# Altium schematic sheet ChildBoard.SchDoc
size A4
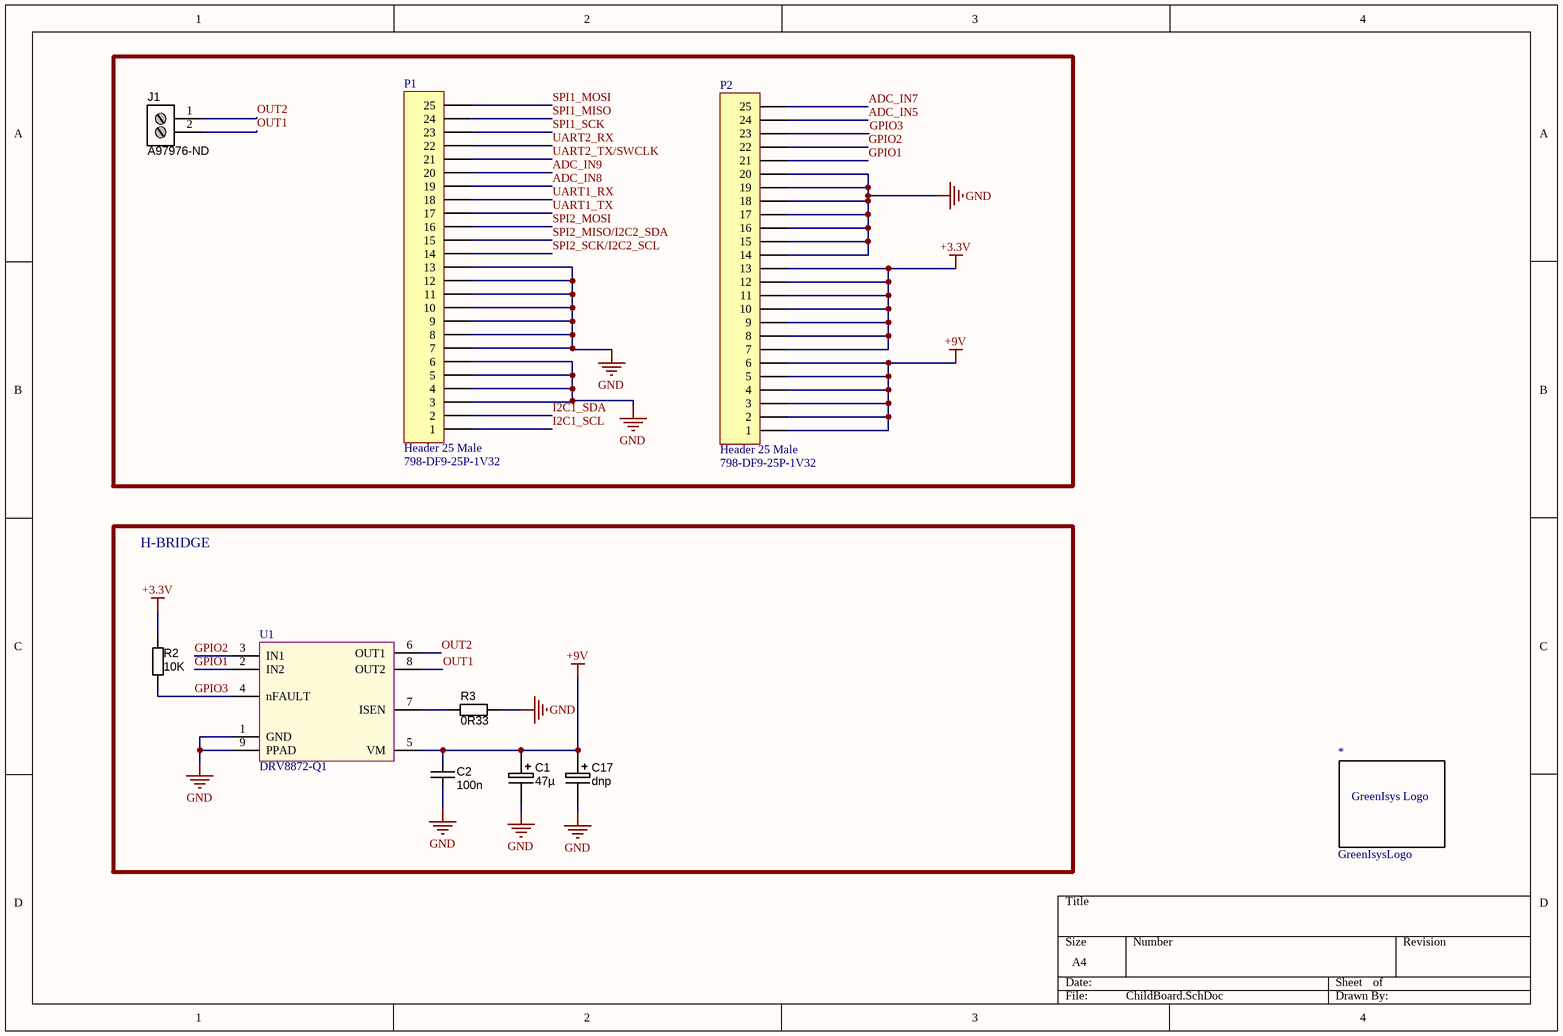
[diagram p0: ChildBoard.SchDoc]

## Parts
*  GreenIsysLogo  [GreenIsys]
C1  47µ  [CAP_ELEC_Size_H13]
C2  value 100n  [CAPC1608N]  (hidden comment: approved sub OK)
C17  dnp  [CAPMP3528X210N]
J1  Supplier Part Number 1: A97976-ND  [2P_PCB_ScrewTerm_90S_3.81MM]  (hidden comment: Stackable ScrewTerm)
P1  Header 25 Male  Supplier Part Number 1: 798-DF9-25P-1V32  [DF9-25S-1V (MALE)]
P2  Header 25 Male  Supplier Part Number 1: 798-DF9-25P-1V32  [DF9-25S-1V (MALE)]
R2  value 10K  [RESC1608N]  (hidden comment: Thick Film)
R3  value 0R33  [RESC3225N]  (hidden comment: Thick Film)
U1  DRV8872-Q1  [HSOP-8-DDA]

## Blocks framed on the sheet
H-BRIDGE: C1 C2 C17 R2 R3 U1

## Nets
+3.3V: P2.7 P2.8 P2.9 P2.10 P2.11 P2.12 P2.13 R2.1
+9V: C1.1 C2.1 C17.1 P2.1 P2.2 P2.3 P2.4 P2.5 P2.6 U1.5(VM)
GND: C1.2 C2.2 C17.2 P1.3 P1.4 P1.5 P1.6 P1.7 P1.8 P1.9 P1.10 P1.11 P1.12 P1.13 P2.14 P2.15 P2.16 P2.17 P2.18 P2.19 P2.20 R3.1 U1.1(GND) U1.9(PPAD)
ADC_IN5: P2.24
ADC_IN7: P2.25
ADC_IN8: P1.19
ADC_IN9: P1.20
GPIO1: P2.21 U1.2(IN2)
GPIO2: P2.22 U1.3(IN1)
GPIO3: P2.23 R2.2 U1.4(nFAULT)
I2C1_SCL: P1.1
I2C1_SDA: P1.2
OUT1: J1.2 U1.8(OUT2)
OUT2: J1.1 U1.6(OUT1)
SPI1_MISO: P1.24
SPI1_MOSI: P1.25
SPI1_SCK: P1.23
SPI2_MISO/I2C2_SDA: P1.15
SPI2_MOSI: P1.16
SPI2_SCK/I2C2_SCL: P1.14
UART1_RX: P1.18
UART1_TX: P1.17
UART2_RX: P1.22
UART2_TX/SWCLK: P1.21
NetR3_2: R3.2 U1.7(ISEN)

## Notes on the sheet
- (in symbol GreenIsysLogo) GreenIsys Logo

## Library data of the parts
C1 = CAPE_47u_100V_SMD: Capacitor SMD Electrolytic 47uF 20% 100V Radial; Manufacturer 1: Panasonic - ECG; Manufacturer Part Number 1: EEV-TG2A470Q; Material: Aluminum Electrolytic; Package / Case: Radial - Surface Mount; Ratings: 100V; Tolerance: ±20%; Supplier 1: Mouser; Supplier Part Number 1: 667-EEV-TG2A470Q; Value: 47µ
C2 = CAPC_10n_0603_50V_10%: Capacitor SMD Cer 100nF 10% 10V X7R 0603; Manufacturer 1: AVX Corporation; Manufacturer Part Number 1: 0603ZC104KAT2A; Ratings: 10V; X7R; Material: ceramic; Package / Case: 0603 (1608 metric); Tolerance: ±10%; Supplier 1: Mouser; Supplier Part Number 1: 581-0603ZC104K; Supplier Unit Price 1: 0.281
C17 = CAPT_47u_3528_6V3: Capacitor SMD Tantalum 47uF 10% 6.3V EIA 3528-21; Manufacturer 1: Kemet; Manufacturer Part Number 1: T489B476K006ATE500; Manufacturer Size Code: A; Material: Solid Tantalum; ESR (Equivalent Series Resistance): 4.000 Ohm; Package / Case: (3528Metric); Ratings: 6.3V; Tolerance: ±10%; Supplier 1: Digi-Key; Supplier Part Number 1: 399-4698-1-ND; Operating Temperature: -55°C ~ 125°C; Size / Dimension: 0.126" L x 0.063" W (3.20mm x 1.60mm); Height - Seated (Max): 0.071" (1.80mm); ComponentLink1URL: http://www.kemet.com/datasheets&T491A686K006AT; ComponentLink1Description: http://www.kemet.com/datasheets&T491A686K006AT; Value: dnp
J1 = 2P_ScrewTerm_90S_3.81MM: Terminal Block Screw Type THT 2-Position 3.81mm pitch; Manufacturer 1: Tyco Electronics; Manufacturer Part Number 1: 1776113-2; Value: 2 position; Pitch: 0.150" (3.81mm); Positions Per Level: 2; Package / Case: Side Entry; 3.81mm pitch; Category: Connectors Interconnects; Color: Black; Supplier 1: Digi-Key
P1 P2 = Header 25 Male: Header, 25-Pin; LatestRevisionDate: 17-Jul-2002; LatestRevisionNote: Re-released for DXP Platform.; Publisher: Altium Limited; Supplier 1: Mouser
R2 = RES_10K_0603_1%: Resistor SMD chip 10k Ohm 0.1W 1% 0603; Manufacturer 1: Vishay; Manufacturer Part Number 1: RCG060310K0JNEA; Ratings: 1/10W; Package / Case: 0603 (1608 Metric); Supplier 1: Mouser; Supplier Part Number 1: 71-RCG060310K0JNEA; Tolerance: ±1%; Manufacturer 1: Manufacturer 1; Supplier Unit Price 1: 0.085
R3 = RES_2R2_1210_5%: Resistor SMD chip 0.33 Ohm 0.5W 1% 1210; Manufacturer 1: Yageo; Manufacturer Part Number 1: RL1210FR-070R33L; Ratings: 1/2 W; Package / Case: 1210 (3225 metric); Tolerance: ±1%; Supplier 1: Mouser; Supplier Part Number 1: 603-RL1210FR-070R33L; ComponentLink1URL: http://industrial.panasonic.com/www-cgi/jvcr13pz.cgi?E+PZ+3+AOA0001+ERJ14YJ2R2U+7+WW; ComponentLink1Description: http://industrial.panasonic.com/www-cgi/jvcr13pz.cgi?E+PZ+3+AOA0001+ERJ14YJ2R2U+7+WW
U1 = DRV8872-Q1: Manufacturer 1: Texas Instruments; Manufacturer Part Number 1: DRV8872DDARQ1; Supplier 1: Mouser; Supplier Part Number 1: 595-DRV8872DDARQ1; Supplier Unit Price 1: 2,10